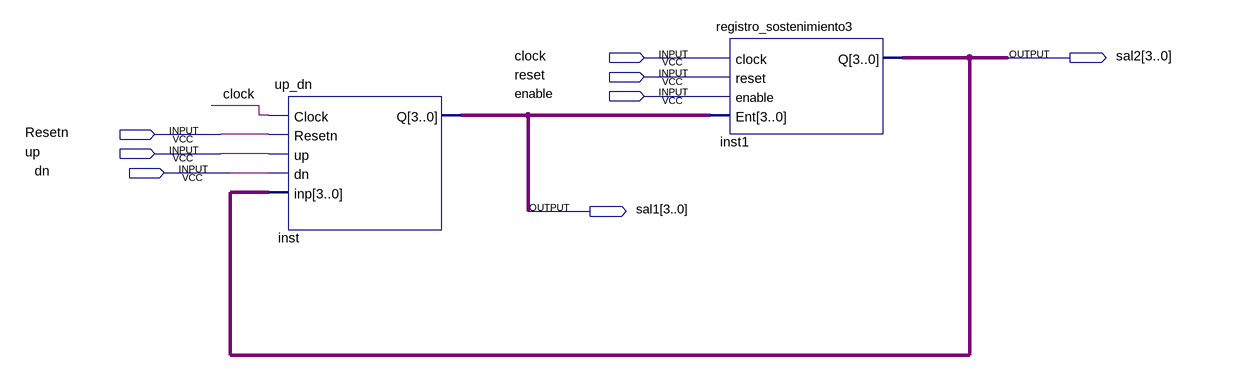
[diagram p0: schematic sheet]
// Quartus schematic contador.bdf as structural Verilog: 2 symbols, 8 pins
module contador (
  input  clock,
  input  reset,
  input  enable,
  input  Resetn,
  input  up,
  input  dn,
  output [3:0] sal2,
  output [3:0] sal1
);

  up_dn inst (.Clock(clock), .Resetn(Resetn), .up(up), .dn(dn), .inp(sal2), .Q(sal1));
  registro_sostenimiento3 inst1 (.clock(clock), .reset(reset), .enable(enable), .Ent(sal1), .Q(sal2));
endmodule
